# Altium schematic sheet 19.RK3588_1.8V_ 3.3V GPIO.SchDoc
size 594 x 420 mm; Revision: V2.1; Schematic Page Number: 11; Page Number: 19; Check: <Checker>; Schematic Name: RK_NVR_DEMO1_RK3588_LP4/4x_V21; Page Count: 43; Page name: 19.RK3588_1.8V/ 3.3V GPIO; Designer: Zhangdz; Schematic Page Count: 99; Revcode: V2.1; DsnPath: E:\Work\SBER\RK3588_SOM\temp\RK_NVR_DEMO1_RK3588_LP4XD200P232SD8_V21_20211228.DSN; SchematicName: RK_NVR_DEMO1_RK3588_LP4/4x_V21; PageName: 19.RK3588_1.8V/ 3.3V GPIO; PageSize: A2; TopSchematic: True
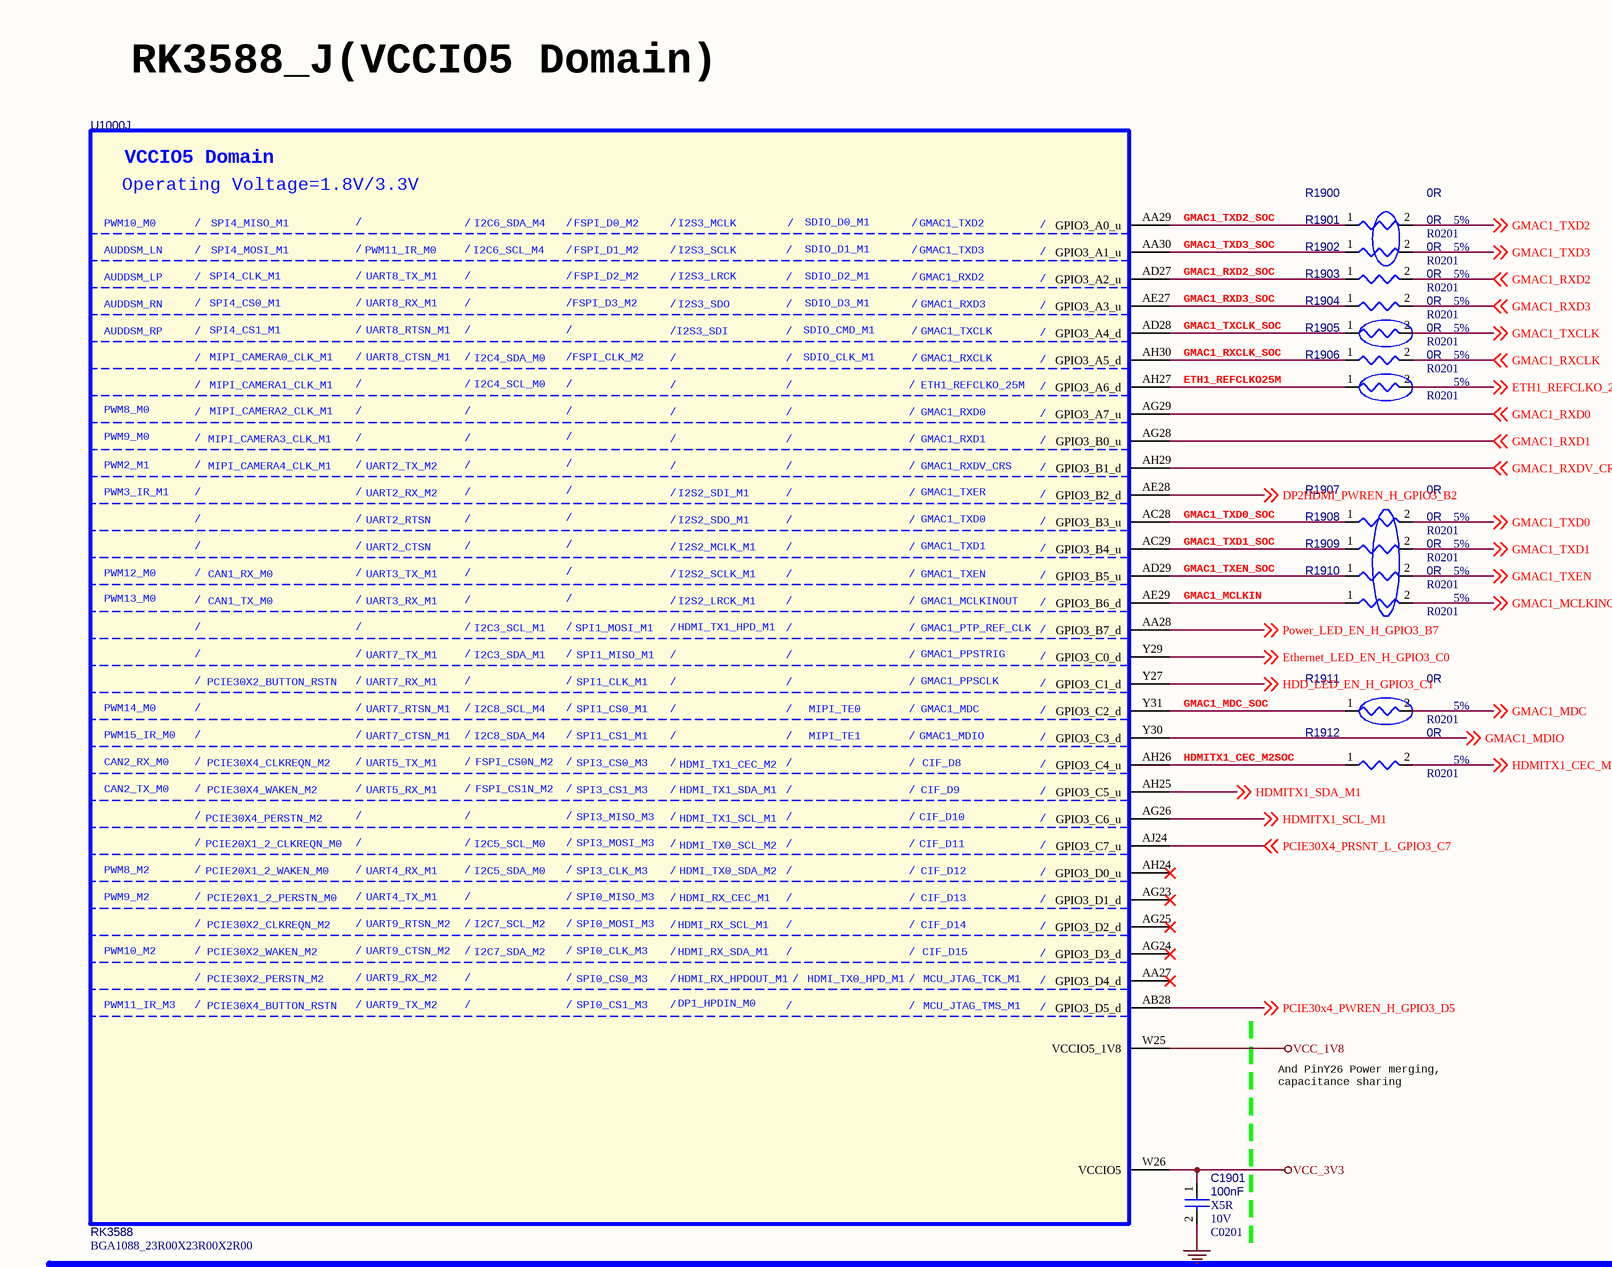
[diagram p0: 19.RK3588_1.8V_ 3.3V GPIO.SchDoc, top left]
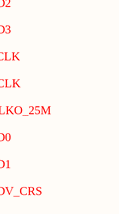
[diagram p1: 19.RK3588_1.8V_ 3.3V GPIO.SchDoc, top right]
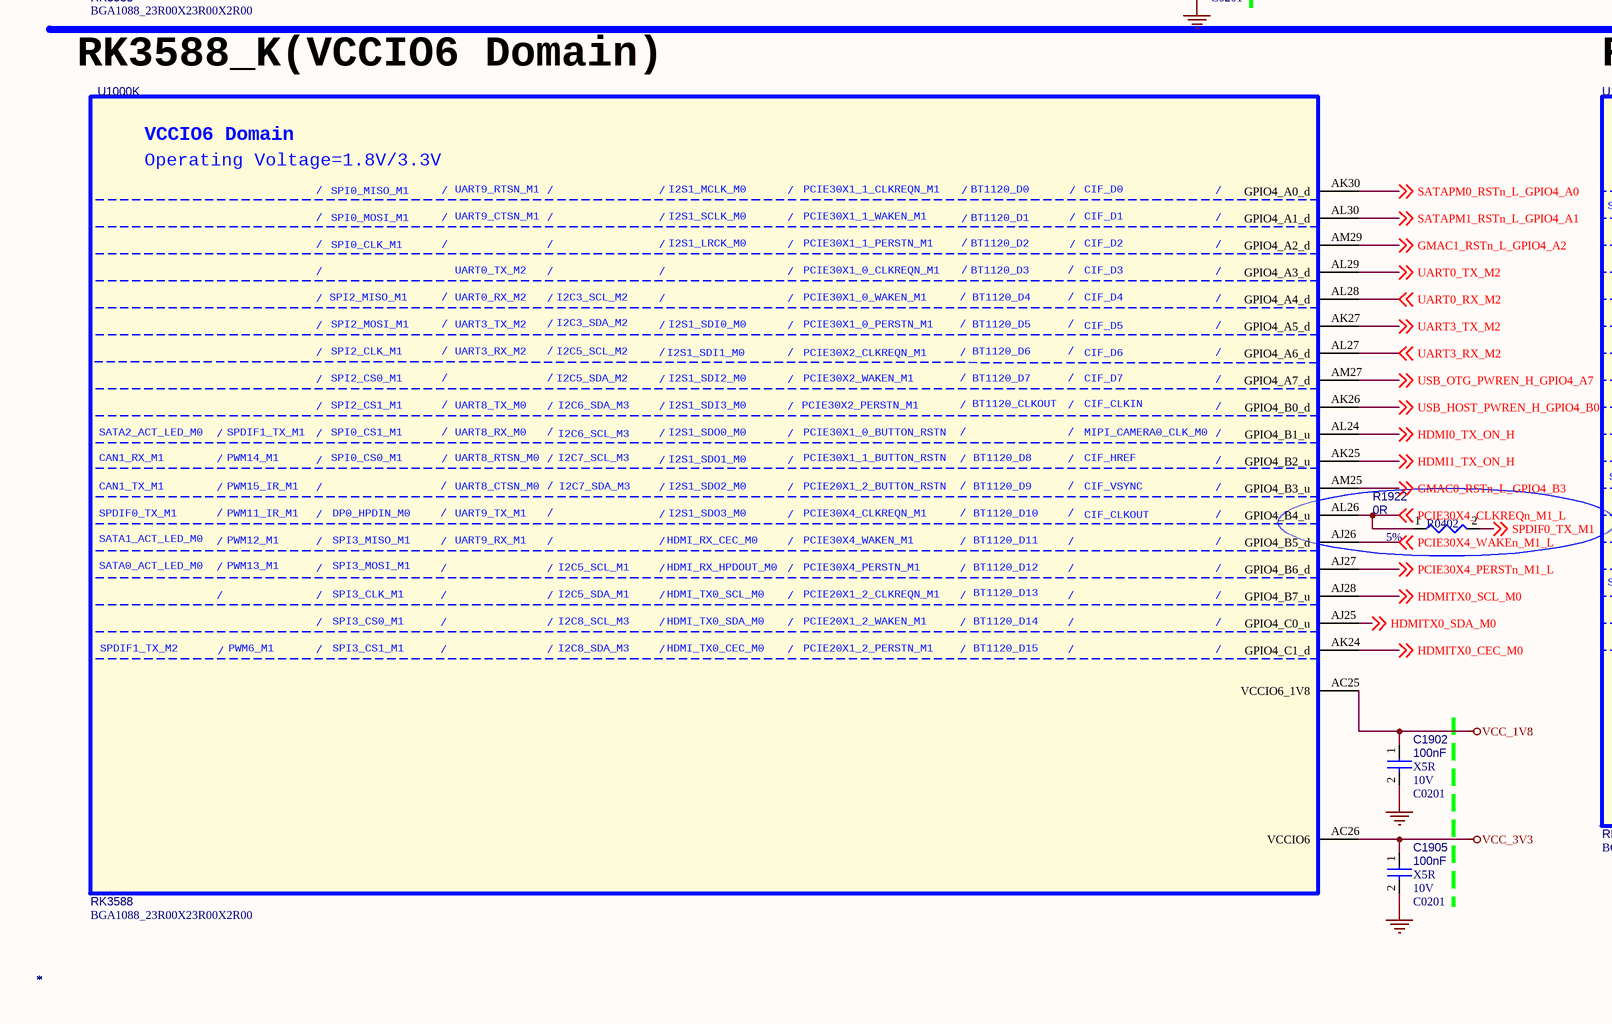
[diagram p2: 19.RK3588_1.8V_ 3.3V GPIO.SchDoc, bottom left]
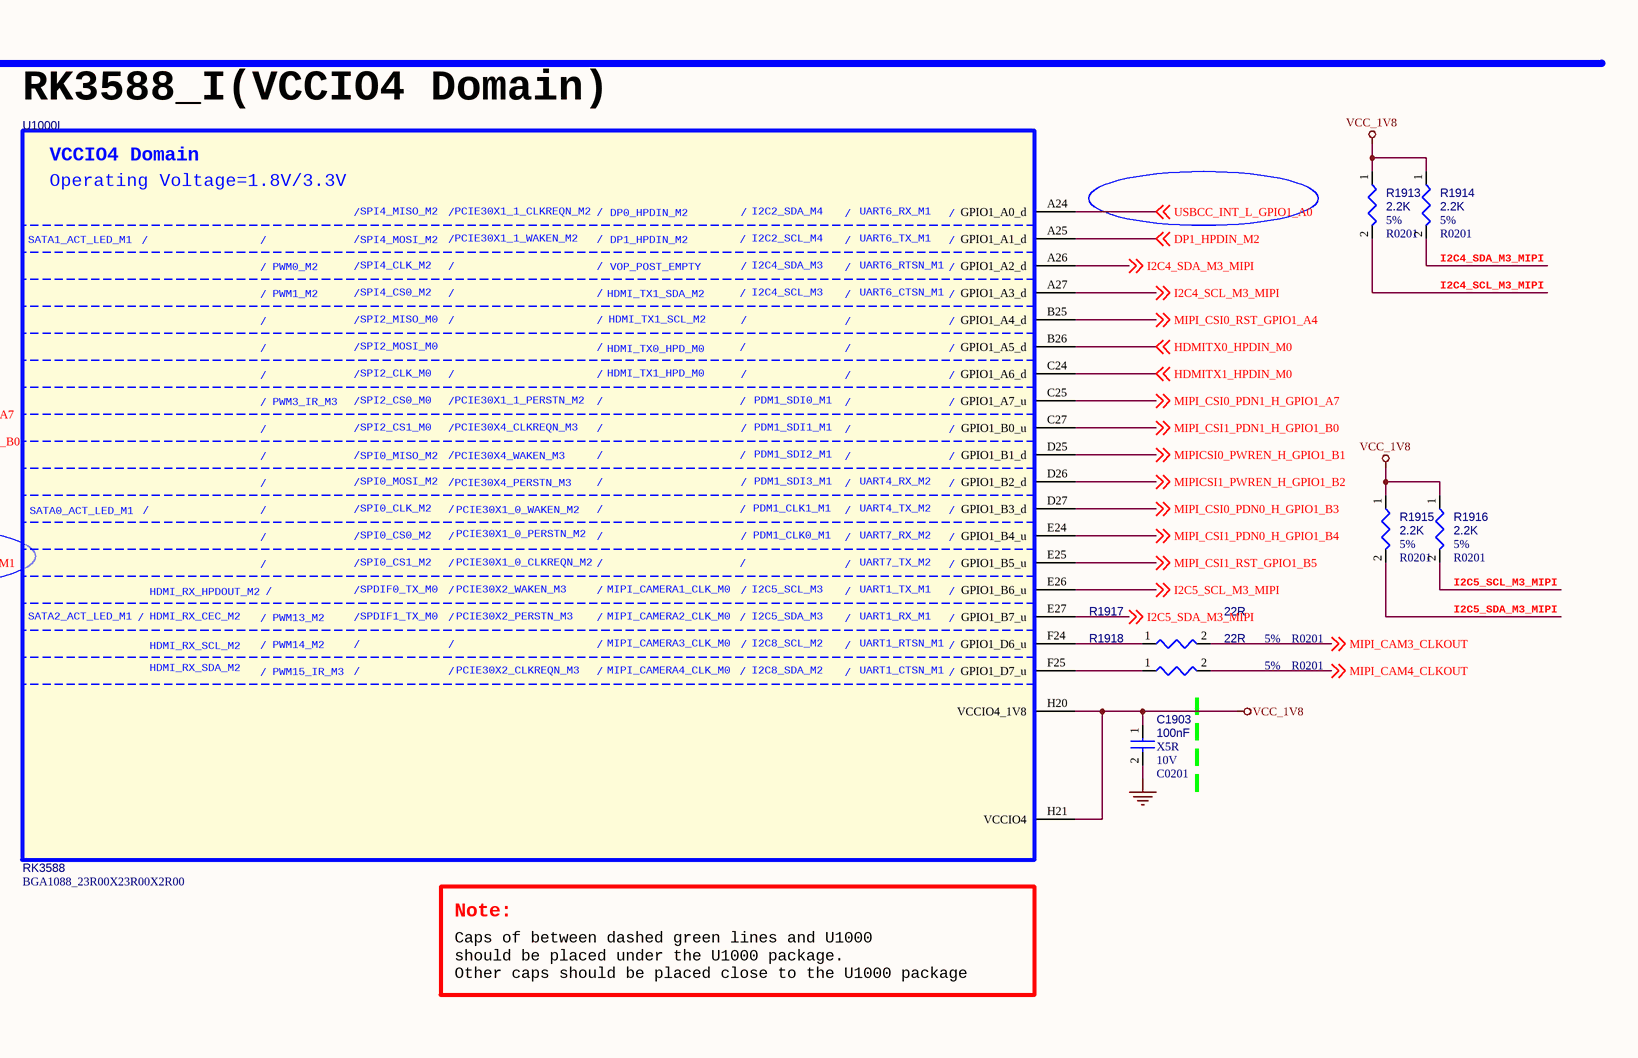
[diagram p3: 19.RK3588_1.8V_ 3.3V GPIO.SchDoc, bottom right]

## Parts
C1901  *  Voltage: 10V  Dielectric: X5R  [C0201]
C1902  *  Voltage: 10V  Dielectric: X5R  [C0201]
C1903  *  Voltage: 10V  Dielectric: X5R  [C0201]
C1905  *  Voltage: 10V  Dielectric: X5R  [C0201]
R1900  *  PCB Footprint: R0201  Tolerance: 5%  [R0402]
R1901  *  PCB Footprint: R0201  Tolerance: 5%  [R0402]
R1902  *  PCB Footprint: R0201  Tolerance: 5%  [R0402]
R1903  *  PCB Footprint: R0201  Tolerance: 5%  [R0402]
R1904  *  PCB Footprint: R0201  Tolerance: 5%  [R0402]
R1905  *  PCB Footprint: R0201  Tolerance: 5%  [R0402]
R1906  *  PCB Footprint: R0201  Tolerance: 5%  [R0402]
R1907  *  PCB Footprint: R0201  Tolerance: 5%  [R0402]
R1908  *  PCB Footprint: R0201  Tolerance: 5%  [R0402]
R1909  *  PCB Footprint: R0201  Tolerance: 5%  [R0402]
R1910  *  PCB Footprint: R0201  Tolerance: 5%  [R0402]
R1911  *  PCB Footprint: R0201  Tolerance: 5%  [R0402]
R1912  *  PCB Footprint: R0201  Tolerance: 5%  [R0402]
R1913  *  PCB Footprint: R0201  Tolerance: 5%  [R0402]
R1914  *  PCB Footprint: R0201  Tolerance: 5%  [R0402]
R1915  *  PCB Footprint: R0201  Tolerance: 5%  [R0402]
R1916  *  PCB Footprint: R0201  Tolerance: 5%  [R0402]
R1917  *  PCB Footprint: R0201  Tolerance: 5%  [R0402]
R1918  *  PCB Footprint: R0201  Tolerance: 5%  [R0402]
R1922  *  Tolerance: 5%  [R0402]
U1000  *  [BGA1088_23R00X23R00X2R00]  (parts I,J,K of 26)

## Nets
GND: C1901.2 C1902.2 C1903.2 C1905.2
VCC_1V8: C1902.1 C1903.1 R1913.1 R1914.1 R1915.1 R1916.1 U1000.AC25(VCCIO6_1V8) U1000.H20(VCCIO4_1V8) U1000.H21(VCCIO4) U1000.W25(VCCIO5_1V8)
VCC_3V3: C1901.1 C1905.1 U1000.AC26(VCCIO6) U1000.W26(VCCIO5)
DP1_HPDIN_M2: U1000.A25(GPIO1_A1_d) ; off-sheet DP1_HPDIN_M2
DP2HDMI_PWREN_H_GPIO3_B2: U1000.AE28(GPIO3_B2_d) ; off-sheet DP2HDMI_PWREN_H_GPIO3_B2
ETH1_REFCLKO25M: R1906.1 U1000.AH27(GPIO3_A6_d)
ETH1_REFCLKO_25M: R1906.2 ; off-sheet ETH1_REFCLKO_25M
Ethernet_LED_EN_H_GPIO3_C0: U1000.Y29(GPIO3_C0_d) ; off-sheet Ethernet_LED_EN_H_GPIO3_C0
GMAC0_RSTn_L_GPIO4_B3: U1000.AM25(GPIO4_B3_u) ; off-sheet GMAC0_RSTn_L_GPIO4_B3
GMAC1_MCLKIN: R1910.1 U1000.AE29(GPIO3_B6_d)
GMAC1_MCLKINOUT: R1910.2 ; off-sheet GMAC1_MCLKINOUT
GMAC1_MDC: R1911.2 ; off-sheet GMAC1_MDC
GMAC1_MDC_SOC: R1911.1 U1000.Y31(GPIO3_C2_d)
GMAC1_MDIO: U1000.Y30(GPIO3_C3_d) ; off-sheet GMAC1_MDIO
GMAC1_RSTn_L_GPIO4_A2: U1000.AM29(GPIO4_A2_d) ; off-sheet GMAC1_RSTn_L_GPIO4_A2
GMAC1_RXCLK: R1905.2 ; off-sheet GMAC1_RXCLK
GMAC1_RXCLK_SOC: R1905.1 U1000.AH30(GPIO3_A5_d)
GMAC1_RXD0: U1000.AG29(GPIO3_A7_u) ; off-sheet GMAC1_RXD0
GMAC1_RXD1: U1000.AG28(GPIO3_B0_u) ; off-sheet GMAC1_RXD1
GMAC1_RXD2: R1902.2 ; off-sheet GMAC1_RXD2
GMAC1_RXD2_SOC: R1902.1 U1000.AD27(GPIO3_A2_u)
GMAC1_RXD3: R1903.2 ; off-sheet GMAC1_RXD3
GMAC1_RXD3_SOC: R1903.1 U1000.AE27(GPIO3_A3_u)
GMAC1_RXDV_CRS: U1000.AH29(GPIO3_B1_d) ; off-sheet GMAC1_RXDV_CRS
GMAC1_TXCLK: R1904.2 ; off-sheet GMAC1_TXCLK
GMAC1_TXCLK_SOC: R1904.1 U1000.AD28(GPIO3_A4_d)
GMAC1_TXD0: R1907.2 ; off-sheet GMAC1_TXD0
GMAC1_TXD0_SOC: R1907.1 U1000.AC28(GPIO3_B3_u)
GMAC1_TXD1: R1908.2 ; off-sheet GMAC1_TXD1
GMAC1_TXD1_SOC: R1908.1 U1000.AC29(GPIO3_B4_u)
GMAC1_TXD2: R1900.2 ; off-sheet GMAC1_TXD2
GMAC1_TXD2_SOC: R1900.1 U1000.AA29(GPIO3_A0_u)
GMAC1_TXD3: R1901.2 ; off-sheet GMAC1_TXD3
GMAC1_TXD3_SOC: R1901.1 U1000.AA30(GPIO3_A1_u)
GMAC1_TXEN: R1909.2 ; off-sheet GMAC1_TXEN
GMAC1_TXEN_SOC: R1909.1 U1000.AD29(GPIO3_B5_u)
HDD_LED_EN_H_GPIO3_C1: U1000.Y27(GPIO3_C1_d) ; off-sheet HDD_LED_EN_H_GPIO3_C1
HDMI0_TX_ON_H: U1000.AL24(GPIO4_B1_u) ; off-sheet HDMI0_TX_ON_H
HDMI1_TX_ON_H: U1000.AK25(GPIO4_B2_u) ; off-sheet HDMI1_TX_ON_H
HDMITX0_CEC_M0: U1000.AK24(GPIO4_C1_d) ; off-sheet HDMITX0_CEC_M0
HDMITX0_HPDIN_M0: U1000.B26(GPIO1_A5_d) ; off-sheet HDMITX0_HPDIN_M0
HDMITX0_SCL_M0: U1000.AJ28(GPIO4_B7_u) ; off-sheet HDMITX0_SCL_M0
HDMITX0_SDA_M0: U1000.AJ25(GPIO4_C0_u) ; off-sheet HDMITX0_SDA_M0
HDMITX1_CEC_M2: R1912.2 ; off-sheet HDMITX1_CEC_M2
HDMITX1_CEC_M2SOC: R1912.1 U1000.AH26(GPIO3_C4_u)
HDMITX1_HPDIN_M0: U1000.C24(GPIO1_A6_d) ; off-sheet HDMITX1_HPDIN_M0
HDMITX1_SCL_M1: U1000.AG26(GPIO3_C6_u) ; off-sheet HDMITX1_SCL_M1
HDMITX1_SDA_M1: U1000.AH25(GPIO3_C5_u) ; off-sheet HDMITX1_SDA_M1
I2C4_SCL_M3_MIPI: R1913.2 U1000.A27(GPIO1_A3_d) ; off-sheet I2C4_SCL_M3_MIPI
I2C4_SDA_M3_MIPI: R1914.2 U1000.A26(GPIO1_A2_d) ; off-sheet I2C4_SDA_M3_MIPI
I2C5_SCL_M3_MIPI: R1916.2 U1000.E26(GPIO1_B6_u) ; off-sheet I2C5_SCL_M3_MIPI
I2C5_SDA_M3_MIPI: R1915.2 U1000.E27(GPIO1_B7_u) ; off-sheet I2C5_SDA_M3_MIPI
MIPI_CAM3_CLKOUT: R1917.2 ; off-sheet MIPI_CAM3_CLKOUT
MIPI_CAM4_CLKOUT: R1918.2 ; off-sheet MIPI_CAM4_CLKOUT
MIPI_CSI0_PDN0_H_GPIO1_B3: U1000.D27(GPIO1_B3_d) ; off-sheet MIPI_CSI0_PDN0_H_GPIO1_B3
MIPI_CSI0_PDN1_H_GPIO1_A7: U1000.C25(GPIO1_A7_u) ; off-sheet MIPI_CSI0_PDN1_H_GPIO1_A7
MIPI_CSI0_RST_GPIO1_A4: U1000.B25(GPIO1_A4_d) ; off-sheet MIPI_CSI0_RST_GPIO1_A4
MIPI_CSI1_PDN0_H_GPIO1_B4: U1000.E24(GPIO1_B4_u) ; off-sheet MIPI_CSI1_PDN0_H_GPIO1_B4
MIPI_CSI1_PDN1_H_GPIO1_B0: U1000.C27(GPIO1_B0_u) ; off-sheet MIPI_CSI1_PDN1_H_GPIO1_B0
MIPI_CSI1_RST_GPIO1_B5: U1000.E25(GPIO1_B5_u) ; off-sheet MIPI_CSI1_RST_GPIO1_B5
MIPICSI0_PWREN_H_GPIO1_B1: U1000.D25(GPIO1_B1_d) ; off-sheet MIPICSI0_PWREN_H_GPIO1_B1
MIPICSI1_PWREN_H_GPIO1_B2: U1000.D26(GPIO1_B2_d) ; off-sheet MIPICSI1_PWREN_H_GPIO1_B2
PCIE30X4_CLKREQn_M1_L: R1922.1 U1000.AL26(GPIO4_B4_u) ; off-sheet PCIE30X4_CLKREQn_M1_L
PCIE30X4_PERSTn_M1_L: U1000.AJ27(GPIO4_B6_d) ; off-sheet PCIE30X4_PERSTn_M1_L
PCIE30X4_PRSNT_L_GPIO3_C7: U1000.AJ24(GPIO3_C7_u) ; off-sheet PCIE30X4_PRSNT_L_GPIO3_C7
PCIE30x4_PWREN_H_GPIO3_D5: U1000.AB28(GPIO3_D5_d) ; off-sheet PCIE30x4_PWREN_H_GPIO3_D5
PCIE30X4_WAKEn_M1_L: U1000.AJ26(GPIO4_B5_d) ; off-sheet PCIE30X4_WAKEn_M1_L
Power_LED_EN_H_GPIO3_B7: U1000.AA28(GPIO3_B7_d) ; off-sheet Power_LED_EN_H_GPIO3_B7
SATAPM0_RSTn_L_GPIO4_A0: U1000.AK30(GPIO4_A0_d) ; off-sheet SATAPM0_RSTn_L_GPIO4_A0
SATAPM1_RSTn_L_GPIO4_A1: U1000.AL30(GPIO4_A1_d) ; off-sheet SATAPM1_RSTn_L_GPIO4_A1
SPDIF0_TX_M1: R1922.2 ; off-sheet SPDIF0_TX_M1
UART0_RX_M2: U1000.AL28(GPIO4_A4_d) ; off-sheet UART0_RX_M2
UART0_TX_M2: U1000.AL29(GPIO4_A3_d) ; off-sheet UART0_TX_M2
UART3_RX_M2: U1000.AL27(GPIO4_A6_d) ; off-sheet UART3_RX_M2
UART3_TX_M2: U1000.AK27(GPIO4_A5_d) ; off-sheet UART3_TX_M2
USB_HOST_PWREN_H_GPIO4_B0: U1000.AK26(GPIO4_B0_d) ; off-sheet USB_HOST_PWREN_H_GPIO4_B0
USB_OTG_PWREN_H_GPIO4_A7: U1000.AM27(GPIO4_A7_d) ; off-sheet USB_OTG_PWREN_H_GPIO4_A7
USBCC_INT_L_GPIO1_A0: U1000.A24(GPIO1_A0_d) ; off-sheet USBCC_INT_L_GPIO1_A0
NetR1917_1: R1917.1 U1000.F24(GPIO1_D6_u)
NetR1918_1: R1918.1 U1000.F25(GPIO1_D7_u)

Not connected (* = marked no-connect by the designer): U1000 AA27(GPIO3_D4_d)* AG23(GPIO3_D1_d)* AG24(GPIO3_D3_d)* AG25(GPIO3_D2_d)* AH24(GPIO3_D0_u)*

## Notes on the sheet
- RK3588_J(VCCIO5 Domain)
- And PinY26 Power merging,
  capacitance sharing
- RK3588_K(VCCIO6 Domain)
- RK3588_I(VCCIO4 Domain)
- Caps of between dashed green lines and U1000
  should be placed under the U1000 package.
  Other caps should be placed close to the U1000 package
- Note:
- (in symbol SOC_RK3588, part I) VCCIO4 Domain; Operating Voltage=1.8V/3.3V; /; SPI4_MISO_M2; PCIE30X1_1_CLKREQN_M2; DP0_HPDIN_M2; I2C2_SDA_M4; UART6_RX_M1; SATA1_ACT_LED_M1; SPI4_MOSI_M2; PCIE30X1_1_WAKEN_M2; DP1_HPDIN_M2; I2C2_SCL_M4; UART6_TX_M1; PWM0_M2; SPI4_CLK_M2; VOP_POST_EMPTY; I2C4_SDA_M3; UART6_RTSN_M1; PWM1_M2; SPI4_CS0_M2; HDMI_TX1_SDA_M2; I2C4_SCL_M3; UART6_CTSN_M1; SPI2_MISO_M0; HDMI_TX1_SCL_M2; SPI2_MOSI_M0; HDMI_TX0_HPD_M0; SPI2_CLK_M0; HDMI_TX1_HPD_M0; PWM3_IR_M3; SPI2_CS0_M0; PCIE30X1_1_PERSTN_M2; PDM1_SDI0_M1; SPI2_CS1_M0; PCIE30X4_CLKREQN_M3; PDM1_SDI1_M1; SPI0_MISO_M2; PCIE30X4_WAKEN_M3; PDM1_SDI2_M1; SPI0_MOSI_M2; PCIE30X4_PERSTN_M3; PDM1_SDI3_M1; UART4_RX_M2; SATA0_ACT_LED_M1; SPI0_CLK_M2; PCIE30X1_0_WAKEN_M2; PDM1_CLK1_M1; UART4_TX_M2; SPI0_CS0_M2; PCIE30X1_0_PERSTN_M2; PDM1_CLK0_M1; UART7_RX_M2; SPI0_CS1_M2; PCIE30X1_0_CLKREQN_M2; UART7_TX_M2; HDMI_RX_HPDOUT_M2; SPDIF0_TX_M0; PCIE30X2_WAKEN_M3; MIPI_CAMERA1_CLK_M0; I2C5_SCL_M3; UART1_TX_M1; SATA2_ACT_LED_M1; HDMI_RX_CEC_M2; PWM13_M2; SPDIF1_TX_M0; PCIE30X2_PERSTN_M3; MIPI_CAMERA2_CLK_M0; I2C5_SDA_M3; UART1_RX_M1; HDMI_RX_SCL_M2; PWM14_M2; MIPI_CAMERA3_CLK_M0; I2C8_SCL_M2; UART1_RTSN_M1; HDMI_RX_SDA_M2; PWM15_IR_M3; PCIE30X2_CLKREQN_M3; MIPI_CAMERA4_CLK_M0; I2C8_SDA_M2; UART1_CTSN_M1
- (in symbol SOC_RK3588, part J) VCCIO5 Domain; Operating Voltage=1.8V/3.3V; PWM10_M0; /; SPI4_MISO_M1; I2C6_SDA_M4; FSPI_D0_M2; I2S3_MCLK; SDIO_D0_M1; GMAC1_TXD2; AUDDSM_LN; SPI4_MOSI_M1; PWM11_IR_M0; I2C6_SCL_M4; FSPI_D1_M2; I2S3_SCLK; SDIO_D1_M1; GMAC1_TXD3; AUDDSM_LP; SPI4_CLK_M1; UART8_TX_M1; FSPI_D2_M2; I2S3_LRCK; SDIO_D2_M1; GMAC1_RXD2; AUDDSM_RN; SPI4_CS0_M1; UART8_RX_M1; FSPI_D3_M2; I2S3_SDO; SDIO_D3_M1; GMAC1_RXD3; AUDDSM_RP; SPI4_CS1_M1; UART8_RTSN_M1; I2S3_SDI; SDIO_CMD_M1; GMAC1_TXCLK; MIPI_CAMERA0_CLK_M1; UART8_CTSN_M1; I2C4_SDA_M0; FSPI_CLK_M2; SDIO_CLK_M1; GMAC1_RXCLK; MIPI_CAMERA1_CLK_M1; I2C4_SCL_M0; ETH1_REFCLKO_25M; PWM8_M0; MIPI_CAMERA2_CLK_M1; GMAC1_RXD0; PWM9_M0; MIPI_CAMERA3_CLK_M1; GMAC1_RXD1; PWM2_M1; MIPI_CAMERA4_CLK_M1; UART2_TX_M2; GMAC1_RXDV_CRS; PWM3_IR_M1; UART2_RX_M2; I2S2_SDI_M1; GMAC1_TXER; UART2_RTSN; I2S2_SDO_M1; GMAC1_TXD0; UART2_CTSN; I2S2_MCLK_M1; GMAC1_TXD1; PWM12_M0; CAN1_RX_M0; UART3_TX_M1; I2S2_SCLK_M1; GMAC1_TXEN; PWM13_M0; CAN1_TX_M0; UART3_RX_M1; I2S2_LRCK_M1; GMAC1_MCLKINOUT; I2C3_SCL_M1; SPI1_MOSI_M1; HDMI_TX1_HPD_M1; GMAC1_PTP_REF_CLK; UART7_TX_M1; I2C3_SDA_M1; SPI1_MISO_M1; GMAC1_PPSTRIG; PCIE30X2_BUTTON_RSTN; UART7_RX_M1; SPI1_CLK_M1; GMAC1_PPSCLK; PWM14_M0; UART7_RTSN_M1; I2C8_SCL_M4; SPI1_CS0_M1; MIPI_TE0; GMAC1_MDC; PWM15_IR_M0; UART7_CTSN_M1; I2C8_SDA_M4; SPI1_CS1_M1; MIPI_TE1; GMAC1_MDIO; CAN2_RX_M0; PCIE30X4_CLKREQN_M2; UART5_TX_M1; FSPI_CS0N_M2; SPI3_CS0_M3; HDMI_TX1_CEC_M2; CIF_D8; CAN2_TX_M0; PCIE30X4_WAKEN_M2; UART5_RX_M1; FSPI_CS1N_M2; SPI3_CS1_M3; HDMI_TX1_SDA_M1; CIF_D9; PCIE30X4_PERSTN_M2; SPI3_MISO_M3; HDMI_TX1_SCL_M1; CIF_D10; PCIE20X1_2_CLKREQN_M0; I2C5_SCL_M0; SPI3_MOSI_M3; HDMI_TX0_SCL_M2; CIF_D11; PWM8_M2; PCIE20X1_2_WAKEN_M0; UART4_RX_M1; I2C5_SDA_M0; SPI3_CLK_M3; HDMI_TX0_SDA_M2; CIF_D12; PWM9_M2; PCIE20X1_2_PERSTN_M0; UART4_TX_M1; SPI0_MISO_M3; HDMI_RX_CEC_M1; CIF_D13; PCIE30X2_CLKREQN_M2; UART9_RTSN_M2; I2C7_SCL_M2; SPI0_MOSI_M3; HDMI_RX_SCL_M1; CIF_D14; PWM10_M2; PCIE30X2_WAKEN_M2; UART9_CTSN_M2; I2C7_SDA_M2; SPI0_CLK_M3; HDMI_RX_SDA_M1; CIF_D15; PCIE30X2_PERSTN_M2; UART9_RX_M2; SPI0_CS0_M3; HDMI_RX_HPDOUT_M1; HDMI_TX0_HPD_M1; MCU_JTAG_TCK_M1; DP1_HPDIN_M0; PWM11_IR_M3; PCIE30X4_BUTTON_RSTN; UART9_TX_M2; SPI0_CS1_M3; MCU_JTAG_TMS_M1
- (in symbol SOC_RK3588, part K) VCCIO6 Domain; Operating Voltage=1.8V/3.3V; /; SPI0_MISO_M1; UART9_RTSN_M1; I2S1_MCLK_M0; PCIE30X1_1_CLKREQN_M1; BT1120_D0; CIF_D0; SPI0_MOSI_M1; UART9_CTSN_M1; I2S1_SCLK_M0; PCIE30X1_1_WAKEN_M1; BT1120_D1; CIF_D1; SPI0_CLK_M1; I2S1_LRCK_M0; PCIE30X1_1_PERSTN_M1; BT1120_D2; CIF_D2; UART0_TX_M2; PCIE30X1_0_CLKREQN_M1; BT1120_D3; CIF_D3; SPI2_MISO_M1; UART0_RX_M2; I2C3_SCL_M2; PCIE30X1_0_WAKEN_M1; BT1120_D4; CIF_D4; SPI2_MOSI_M1; UART3_TX_M2; I2C3_SDA_M2; I2S1_SDI0_M0; PCIE30X1_0_PERSTN_M1; BT1120_D5; CIF_D5; SPI2_CLK_M1; UART3_RX_M2; I2C5_SCL_M2; I2S1_SDI1_M0; PCIE30X2_CLKREQN_M1; BT1120_D6; CIF_D6; SPI2_CS0_M1; I2C5_SDA_M2; I2S1_SDI2_M0; PCIE30X2_WAKEN_M1; BT1120_D7; CIF_D7; SPI2_CS1_M1; UART8_TX_M0; I2C6_SDA_M3; I2S1_SDI3_M0; PCIE30X2_PERSTN_M1; BT1120_CLKOUT; CIF_CLKIN; SATA2_ACT_LED_M0; SPDIF1_TX_M1; SPI0_CS1_M1; UART8_RX_M0; I2C6_SCL_M3; I2S1_SDO0_M0; PCIE30X1_0_BUTTON_RSTN; MIPI_CAMERA0_CLK_M0; CAN1_RX_M1; PWM14_M1; SPI0_CS0_M1; UART8_RTSN_M0; I2C7_SCL_M3; I2S1_SDO1_M0; PCIE30X1_1_BUTTON_RSTN; BT1120_D8; CIF_HREF; CAN1_TX_M1; PWM15_IR_M1; UART8_CTSN_M0; I2C7_SDA_M3; I2S1_SDO2_M0; PCIE20X1_2_BUTTON_RSTN; BT1120_D9; CIF_VSYNC; SPDIF0_TX_M1; PWM11_IR_M1; DP0_HPDIN_M0; UART9_TX_M1; I2S1_SDO3_M0; PCIE30X4_CLKREQN_M1; BT1120_D10; CIF_CLKOUT; SATA1_ACT_LED_M0; PWM12_M1; SPI3_MISO_M1; UART9_RX_M1; HDMI_RX_CEC_M0; PCIE30X4_WAKEN_M1; BT1120_D11; SATA0_ACT_LED_M0; PWM13_M1; SPI3_MOSI_M1; I2C5_SCL_M1; HDMI_RX_HPDOUT_M0; PCIE30X4_PERSTN_M1; BT1120_D12; SPI3_CLK_M1; I2C5_SDA_M1; HDMI_TX0_SCL_M0; PCIE20X1_2_CLKREQN_M1; BT1120_D13; SPI3_CS0_M1; I2C8_SCL_M3; HDMI_TX0_SDA_M0; PCIE20X1_2_WAKEN_M1; BT1120_D14; SPDIF1_TX_M2; PWM6_M1; SPI3_CS1_M1; I2C8_SDA_M3; HDMI_TX0_CEC_M0; PCIE20X1_2_PERSTN_M1; BT1120_D15

## Library data of the parts
C1901 = CAP NP: cap,100.00nF,+/-10%,10V,X5R,C0201; Part Reference: C1901; Manufacturer: TDK; Value: 100nF; RK PN: C0603X5R1A104K030BC; Priority: A; Tolerance: 10%; PCB Footprint: C0201; Part Type: C0201; Manufacturer PN: C0603X5R1A104K030BC; Created by: JJJ
C1902 = CAP NP: cap,100.00nF,+/-10%,10V,X5R,C0201; Part Reference: C1902; Manufacturer PN: C0603X5R1A104K030BC; Manufacturer: TDK; Value: 100nF; Tolerance: 10%; Priority: A; PCB Footprint: C0201; Created by: JJJ; Part Type: C0201; RK PN: C0603X5R1A104K030BC
C1903 = CAP NP: cap,100.00nF,+/-10%,10V,X5R,C0201; Part Reference: C1903; Manufacturer PN: C0603X5R1A104K030BC; Manufacturer: TDK; Value: 100nF; Tolerance: 10%; Priority: A; PCB Footprint: C0201; Created by: JJJ; Part Type: C0201; RK PN: C0603X5R1A104K030BC
C1905 = CAP NP: cap,100.00nF,+/-10%,10V,X5R,C0201; Part Reference: C1905; Manufacturer: TDK; Value: 100nF; RK PN: C0603X5R1A104K030BC; Priority: A; Tolerance: 10%; PCB Footprint: C0201; Part Type: C0201; Manufacturer PN: C0603X5R1A104K030BC; Created by: JJJ
R1900 = RESISTOR_Dup1: НЁУГєсД¤µзЧи,0R,+/-5%,R0201,1/20W.; Part Reference: R1900; Manufacturer: YAGEO; RK PN: RC0201JR-070RL; Priority: A; Wattage: 1/20W; Value: 0R; Part Type: НЁУГєсД¤µзЧи; Manufacturer PN: RC0201JR-070RL; Created by: YTL
R1901 = RESISTOR_Dup1: НЁУГєсД¤µзЧи,0R,+/-5%,R0201,1/20W.; Part Reference: R1901; Manufacturer: YAGEO; RK PN: RC0201JR-070RL; Priority: A; Wattage: 1/20W; Value: 0R; Part Type: НЁУГєсД¤µзЧи; Manufacturer PN: RC0201JR-070RL; Created by: YTL
R1902 = RESISTOR_Dup1: НЁУГєсД¤µзЧи,0R,+/-5%,R0201,1/20W.; Part Reference: R1902; Manufacturer PN: RC0201JR-070RL; Manufacturer: YAGEO; Wattage: 1/20W; Priority: A; Value: 0R; Created by: YTL; Part Type: НЁУГєсД¤µзЧи; RK PN: RC0201JR-070RL
R1903 = RESISTOR_Dup1: НЁУГєсД¤µзЧи,0R,+/-5%,R0201,1/20W.; Part Reference: R1903; Manufacturer PN: RC0201JR-070RL; Manufacturer: YAGEO; Wattage: 1/20W; Priority: A; Value: 0R; Created by: YTL; Part Type: НЁУГєсД¤µзЧи; RK PN: RC0201JR-070RL
R1904 = RESISTOR_Dup1: НЁУГєсД¤µзЧи,0R,+/-5%,R0201,1/20W.; Part Reference: R1904; Manufacturer PN: RC0201JR-070RL; Manufacturer: YAGEO; Wattage: 1/20W; Priority: A; Value: 0R; Created by: YTL; Part Type: НЁУГєсД¤µзЧи; RK PN: RC0201JR-070RL
R1905 = RESISTOR_Dup1: НЁУГєсД¤µзЧи,0R,+/-5%,R0201,1/20W.; Part Reference: R1905; Manufacturer: YAGEO; RK PN: RC0201JR-070RL; Priority: A; Wattage: 1/20W; Value: 0R; Part Type: НЁУГєсД¤µзЧи; Manufacturer PN: RC0201JR-070RL; Created by: YTL
R1906 = RESISTOR_Dup1: НЁУГєсД¤µзЧи,0R,+/-5%,R0201,1/20W.; Part Reference: R1906; Manufacturer PN: RC0201JR-070RL; Manufacturer: YAGEO; Wattage: 1/20W; Priority: A; Value: 0R; Created by: YTL; Part Type: НЁУГєсД¤µзЧи; RK PN: RC0201JR-070RL
R1907 = RESISTOR_Dup1: НЁУГєсД¤µзЧи,0R,+/-5%,R0201,1/20W.; Part Reference: R1907; Manufacturer PN: RC0201JR-070RL; Manufacturer: YAGEO; Wattage: 1/20W; Priority: A; Value: 0R; Created by: YTL; Part Type: НЁУГєсД¤µзЧи; RK PN: RC0201JR-070RL
R1908 = RESISTOR_Dup1: НЁУГєсД¤µзЧи,0R,+/-5%,R0201,1/20W.; Part Reference: R1908; Manufacturer PN: RC0201JR-070RL; Manufacturer: YAGEO; Wattage: 1/20W; Priority: A; Value: 0R; Created by: YTL; Part Type: НЁУГєсД¤µзЧи; RK PN: RC0201JR-070RL
R1909 = RESISTOR_Dup1: НЁУГєсД¤µзЧи,0R,+/-5%,R0201,1/20W.; Part Reference: R1909; Manufacturer PN: RC0201JR-070RL; Manufacturer: YAGEO; Wattage: 1/20W; Priority: A; Value: 0R; Created by: YTL; Part Type: НЁУГєсД¤µзЧи; RK PN: RC0201JR-070RL
R1910 = RESISTOR_Dup1: НЁУГєсД¤µзЧи,0R,+/-5%,R0201,1/20W.; Part Reference: R1910; Manufacturer PN: RC0201JR-070RL; Manufacturer: YAGEO; Wattage: 1/20W; Priority: A; Value: 0R; Created by: YTL; Part Type: НЁУГєсД¤µзЧи; RK PN: RC0201JR-070RL
R1911 = RESISTOR_Dup1: НЁУГєсД¤µзЧи,0R,+/-5%,R0201,1/20W.; Part Reference: R1911; Manufacturer PN: RC0201JR-070RL; Manufacturer: YAGEO; Wattage: 1/20W; Priority: A; Value: 0R; Created by: YTL; Part Type: НЁУГєсД¤µзЧи; RK PN: RC0201JR-070RL
R1912 = RESISTOR_Dup1: НЁУГєсД¤µзЧи,0R,+/-5%,R0201,1/20W.; Part Reference: R1912; Manufacturer PN: RC0201JR-070RL; Manufacturer: YAGEO; Wattage: 1/20W; Priority: A; Value: 0R; Created by: YTL; Part Type: НЁУГєсД¤µзЧи; RK PN: RC0201JR-070RL
R1913 = RESISTOR_Dup1: НЁУГєсД¤µзЧи,2K2,+/-5%,R0201,1/20W.; Part Reference: R1913; Manufacturer PN: RC0201JR-072K2L; Manufacturer: YAGEO; Value: 2.2K; Wattage: 1/20W; Priority: A; Created by: YTL; Part Type: НЁУГєсД¤µзЧи; RK PN: RC0201JR-072K2L
R1914 = RESISTOR_Dup1: НЁУГєсД¤µзЧи,2K2,+/-5%,R0201,1/20W.; Part Reference: R1914; Manufacturer: YAGEO; Value: 2.2K; RK PN: RC0201JR-072K2L; Priority: A; Wattage: 1/20W; Part Type: НЁУГєсД¤µзЧи; Manufacturer PN: RC0201JR-072K2L; Created by: YTL
R1915 = RESISTOR_Dup1: НЁУГєсД¤µзЧи,2K2,+/-5%,R0201,1/20W.; Part Reference: R1915; Manufacturer PN: RC0201JR-072K2L; Manufacturer: YAGEO; Value: 2.2K; Wattage: 1/20W; Priority: A; Created by: YTL; Part Type: НЁУГєсД¤µзЧи; RK PN: RC0201JR-072K2L
R1916 = RESISTOR_Dup1: НЁУГєсД¤µзЧи,2K2,+/-5%,R0201,1/20W.; Part Reference: R1916; Manufacturer: YAGEO; Value: 2.2K; RK PN: RC0201JR-072K2L; Priority: A; Wattage: 1/20W; Part Type: НЁУГєсД¤µзЧи; Manufacturer PN: RC0201JR-072K2L; Created by: YTL
R1917 = RESISTOR_Dup1: НЁУГєсД¤µзЧи,22R,+/-5%,R0201,1/20W.; Part Reference: R1917; Manufacturer: YAGEO; RK PN: RC0201JR-0722RL; Priority: A; Wattage: 1/20W; Value: 22R; Part Type: НЁУГєсД¤µзЧи; Manufacturer PN: RC0201JR-0722RL; Created by: YTL
R1918 = RESISTOR_Dup1: НЁУГєсД¤µзЧи,22R,+/-5%,R0201,1/20W.; Part Reference: R1918; Manufacturer: YAGEO; RK PN: RC0201JR-0722RL; Priority: A; Wattage: 1/20W; Value: 22R; Part Type: НЁУГєсД¤µзЧи; Manufacturer PN: RC0201JR-0722RL; Created by: YTL
R1922 = RESISTOR_Dup1: НЁУГєсД¤µзЧи,0R,+/-5%,R0402,1/16W.; Part Reference: R1922; Manufacturer PN: RC0402JR-070RL; Manufacturer: YAGEO; Wattage: 1/16W; Priority: A; PCB Footprint: R0402; Value: 0R; Created by: YTL; Part Type: НЁУГєсД¤µзЧи; RK PN: RC0402JR-070RL
U1000 = SOC_RK3588: ROCKCHIP SOC; Part Reference: U1000; Manufacturer: Rockchip (ИрРѕОў); SPLIT_INST: TRUE; SWAP_INFO: (S1+S2+S3+S4+S5+S6+S7+S8+S9+S10+S11+S12+S13+S14+S15+S16+S17+S18+S19+S20+S21+S22+S23+S24+S25+S26); Value: RK3588; Priority: A; Created by: YWQ; Manufacturer PN: RK3588; Part Type: SOC; RK PN: RK3588; PCB Footprint: BGA1088_23R00X23R00X2R00